# Altium schematic sheet Diagram_Power.SchDoc
size A
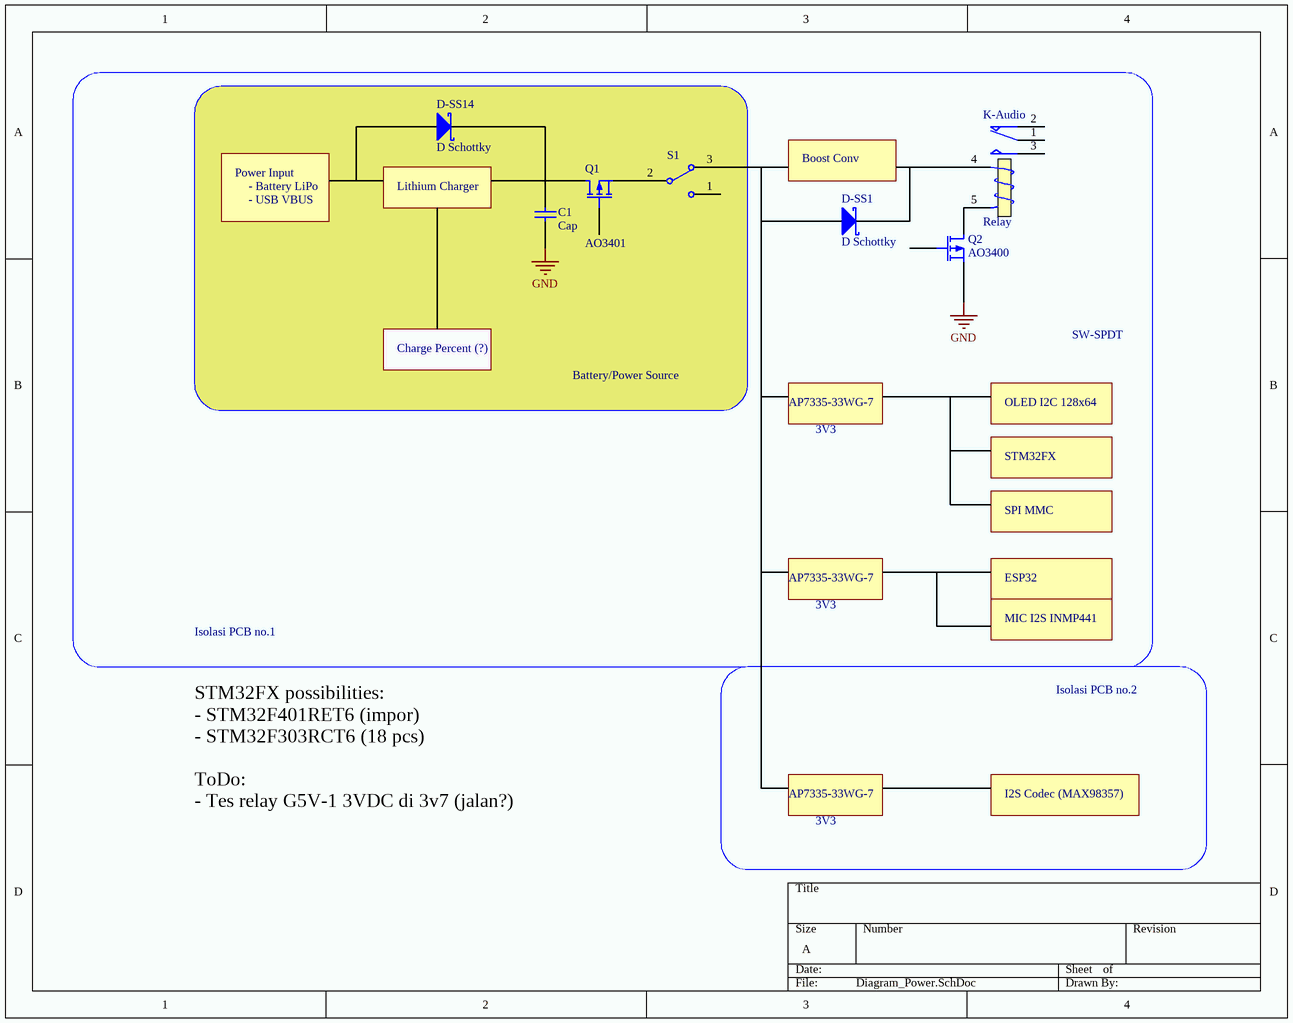
[diagram p0: Diagram_Power.SchDoc]

## Parts
C1  Cap  [RAD-0.3]
D-SS1  D Schottky  [SMB]
D-SS14  D Schottky  [SMB]
K-Audio  Relay  [MODULE5B]
Q1  AO3401  [E3]
Q2  AO3400  [E3]
S1  SW-SPDT  [TL36WW15050]

## Nets
NetK-Audio_5: K-Audio.5(T2) Q2.1(D)
NetQ1_3: Q1.3(S) S1.2

Not connected (* = marked no-connect by the designer): C1 1 2; D-SS1 1(A) 2(K); D-SS14 1(A) 2(K); K-Audio 1(COM) 2(NC) 3(NO) 4(T1); Q1 1(D) 2(G); Q2 2(G) 3(S); S1 1 3

## Notes on the sheet
- Boost Conv
- Power Input
- - Battery LiPo
- - USB VBUS
- Lithium Charger
- Charge Percent (?)
- Battery/Power Source
- AP7335-33WG-7
- 3V3
- OLED I2C 128x64
- STM32FX
- SPI MMC
- Isolasi PCB no.1
- ESP32
- MIC I2S INMP441
- Isolasi PCB no.2
- STM32FX possibilities:
  - STM32F401RET6 (impor)
  - STM32F303RCT6 (18 pcs)
  ToDo:
  - Tes relay G5V-1 3VDC di 3v7 (jalan?)
- I2S Codec (MAX98357)
- Labels drawn without touching a wire or pin: GND

## Library data of the parts
C1 = Cap: Capacitor; Published: 8-Jun-2000; LatestRevisionDate: 17-Jul-2002; LatestRevisionNote: Re-released for DXP Platform.; PackageReference: RAD-0.3; Publisher: Altium Limited; PackageDescription: Radial Cap, Thru-Hole; 2 Leads; 0.3 in Pin Spacing
D-SS1 D-SS14 = D Schottky: Schottky Diode; Published: 8-Jun-2000; LatestRevisionDate: 17-Jul-2002; LatestRevisionNote: Re-released for DXP Platform.; PackageReference: SMB; Publisher: Altium Limited; PackageDescription: DO-214-AA/SMB; 2 C-Bend Leads; Body 5.3 x 3.6 mm, inc. leads (LxW); Code_JEDEC: DO-214-AA
K-Audio = Relay: SPDT Relay; Published: 8-Jun-2000; LatestRevisionDate: 17-Jul-2002; LatestRevisionNote: Re-released for DXP Platform.; PackageReference: MODULE5B; Publisher: Altium Limited
Q1 Q2 = MOSFET-P: P-Channel MOSFET; Published: 8-Jun-2000; LatestRevisionDate: 17-Jul-2002; LatestRevisionNote: Re-released for DXP Platform.; PackageVersion: 1995/1996; PackageReference: E3; Publisher: Altium Limited; PackageDescription: TO, Flat Index; 3 In-Line, Axial Leads; Body Dia. 4.6mm; Lead Dia. 0.5 mm (max)
S1 = SW-SPDT: SPDT Subminiature Toggle Switch, Right Angle Mounting, Vertical Actuation; Published: 24-Mar-1999; LatestRevisionDate: 17-Dec-2003; LatestRevisionNote: Schematic revised, PCB Footprint replaced.; DatasheetVersion: 05-Dec-2000; PackageReference: TL36WW15050; Publisher: Altium Limited; PackageDescription: Switch; 4 Leads; ComponentLink1Description: Manufacturer Link; ComponentLink1URL: http://www.apem.com